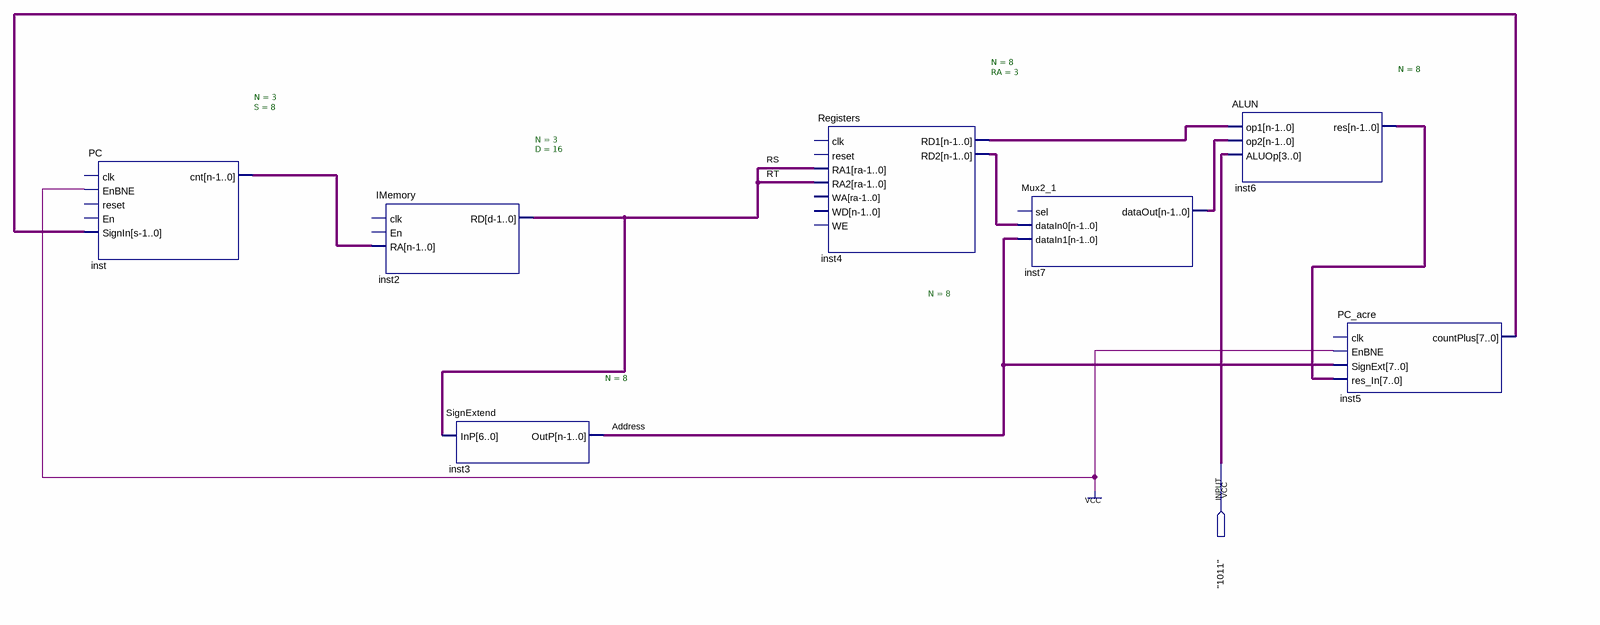
[diagram p0: schematic sheet]
// Quartus schematic BNE.bdf as structural Verilog: 7 symbols, 1 pins
module BNE (
  input  \"1011" 
);

  wire Address, RS, RT;
  wire [2:0] inst_cnt;
  wire [3:0] undriven;
  wire [7:0] inst4_rd1, inst4_rd2, inst5_countplus, inst6_res, inst7_dataout;

  PC #(.N(3), .S(8)) inst (.EnBNE(1'b1), .SignIn(inst5_countplus), .cnt(inst_cnt));  // open: clk, reset, En
  IMemory #(.N(3), .D(16)) inst2 (.RA(inst_cnt), .RD(RS));  // open: clk, En
  SignExtend #(.N(8)) inst3 (.InP({7{RS}}), .OutP(Address));
  Registers #(.N(8), .RA(3)) inst4 (
    .RA1({3{RS}}), .RA2({3{RT}}), .RD1(inst4_rd1), .RD2(inst4_rd2));  // open: clk, reset, WA, WD, WE
  Mux2_1 #(.N(8)) inst7 (.dataIn0(inst4_rd2), .dataIn1({8{Address}}), .dataOut(inst7_dataout));  // open: sel
  ALUN #(.N(8)) inst6 (.op1(inst4_rd1), .op2(inst7_dataout), .ALUOp(undriven), .res(inst6_res));
  PC_acre inst5 (.EnBNE(1'b1), .SignExt({8{Address}}), .res_In(inst6_res), .countPlus(inst5_countplus));  // open: clk
endmodule
